# EAGLE design Pi Wedge (EAGLE 6.5.0)
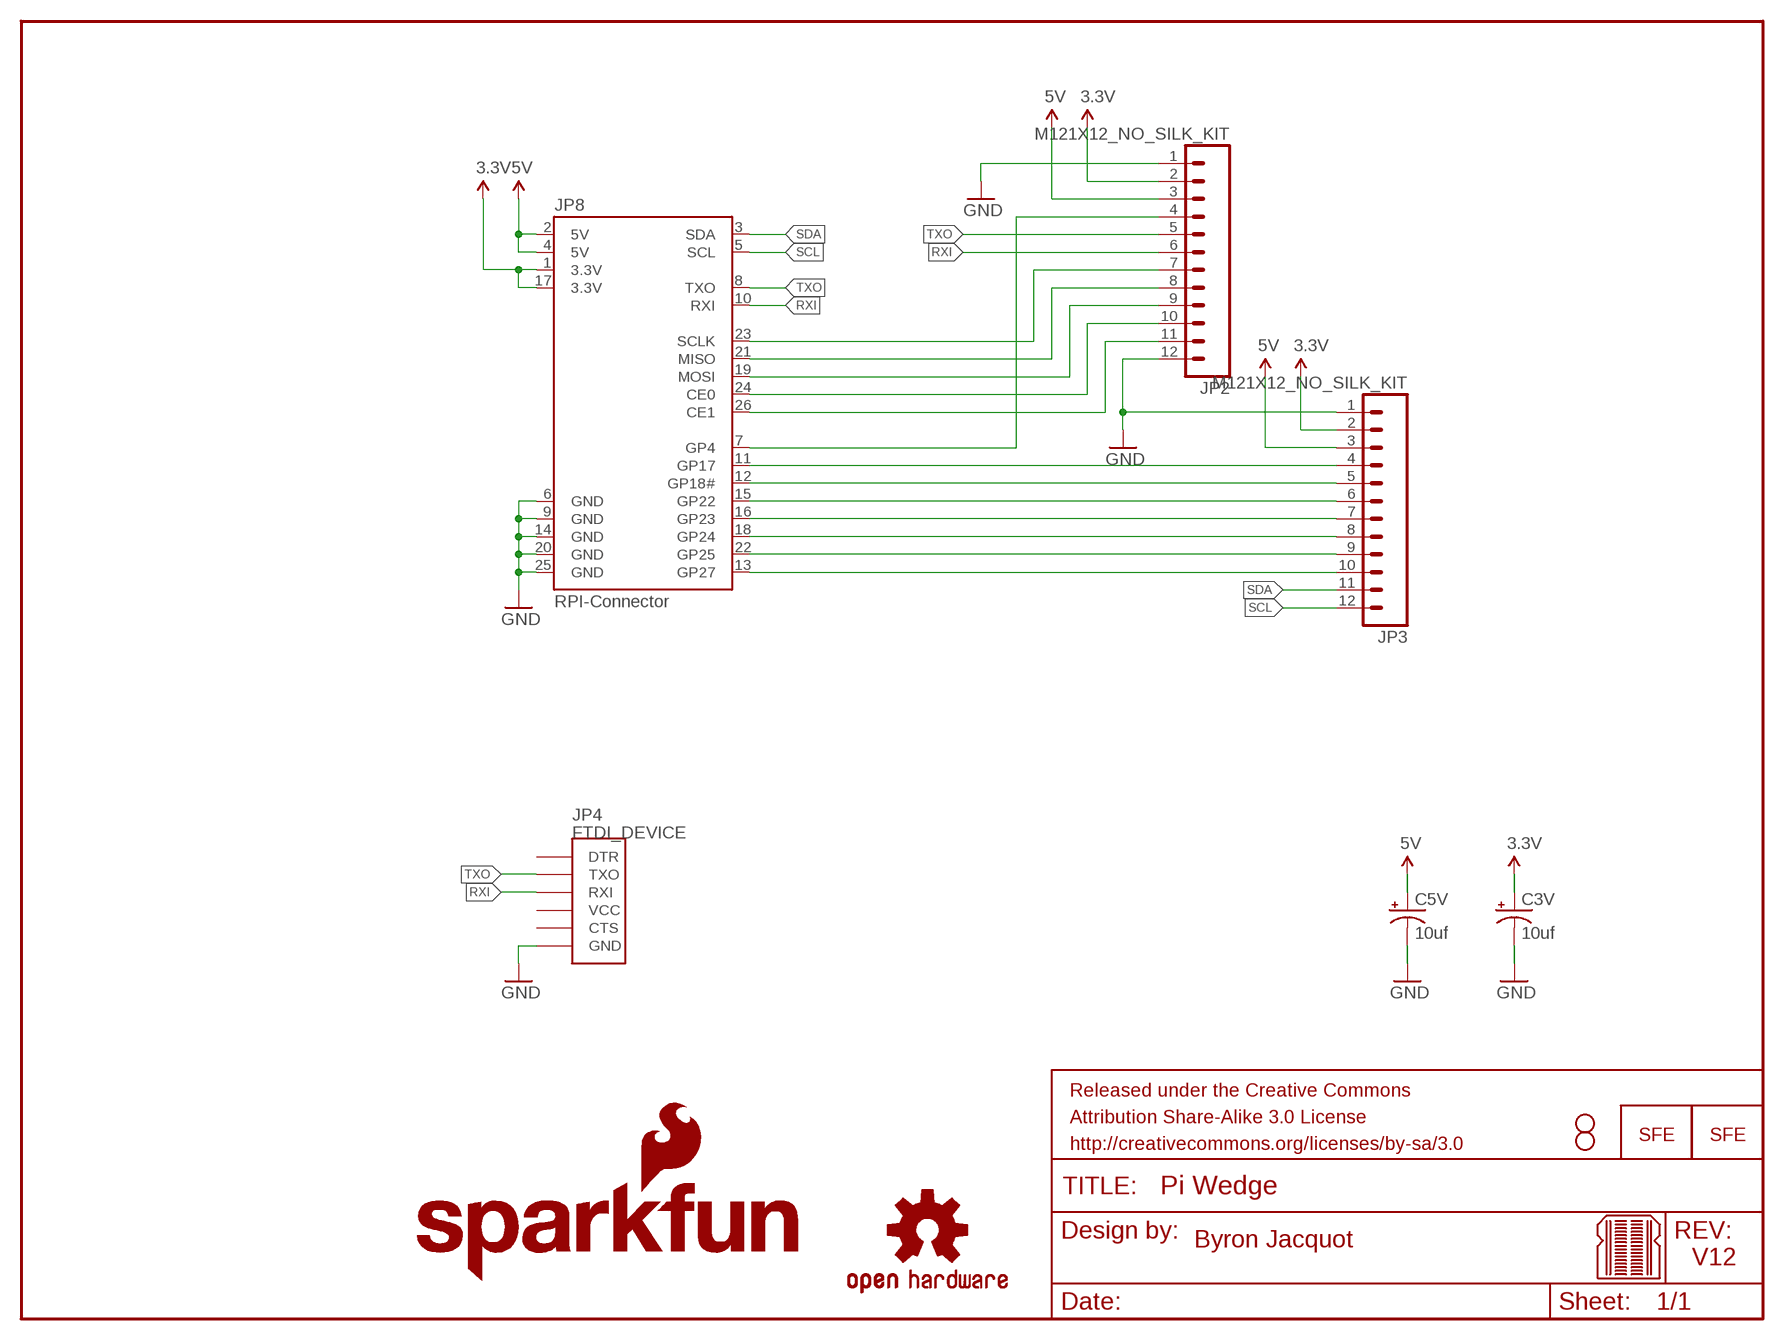
[diagram p0: schematic, sheet 1]

## Parts
C3V  10uf  10UF-25V-20%(PTH)KIT  [CPOL-RADIAL-10UF-25V-KIT]
C5V  10uf  10UF-25V-20%(PTH)KIT  [CPOL-RADIAL-10UF-25V-KIT]
FRAME2  FRAME-LETTER  [CREATIVE_COMMONS]
JP1  LOGO-SFESK  [SFE-LOGO-FLAME]
JP2  M121X12_NO_SILK_KIT  [1X12_NO_SILK_KIT]
JP3  M121X12_NO_SILK_KIT  [1X12_NO_SILK_KIT]
JP4  FTDI_DEVICE  [FTDI_DEVICE_SIDE]
JP5  LOGO-SFESK  [SFE-LOGO-FLAME]
JP8  RPI-Connector  RASPBERRYPI-GPIOPTH  [2X13-SHROUDED]
LOGO1  SFE_LOGO_NAME_FLAME.2_INCH  [SFE_LOGO_NAME_FLAME_.2]
STANDOFF1  STAND-OFF  [STAND-OFF]
STANDOFF2  STAND-OFF  [STAND-OFF]
U$1  OSHW-LOGOS  [OSHW-LOGO-S]
U$2  BREADBOARD_PATTERN  [BREADBOARD_SPACING]

## Nets
3.3V: C3V.1(+) JP2.2 JP3.2 JP8.1(3.3V) JP8.17(3.3V)
5V: C5V.1(+) JP2.3 JP3.3 JP8.2(5V) JP8.4(5V)
CE0: JP2.10 JP8.24(CE0)
CE1: JP2.11 JP8.26(CE1)
GND: C3V.2(-) C5V.2(-) JP2.1 JP2.12 JP3.1 JP4.P$6(GND) JP8.6(GND) JP8.9(GND) JP8.14(GND) JP8.20(GND) JP8.25(GND)
GP4: JP2.4 JP8.7(GP4)
GP17: JP3.4 JP8.11(GP17)
GP18: JP3.5 JP8.12(GP18#)
GP22: JP3.6 JP8.15(GP22)
GP23: JP3.7 JP8.16(GP23)
GP24: JP3.8 JP8.18(GP24)
GP25: JP3.9 JP8.22(GP25)
GP27: JP3.10 JP8.13(GP27)
MISO: JP2.8 JP8.21(MISO)
MOSI: JP2.9 JP8.19(MOSI)
RXI: JP2.6 JP4.P$3(RXI) JP8.10(RXI)
SCL: JP3.12 JP8.5(SCL)
SCLK: JP2.7 JP8.23(SCLK)
SDA: JP3.11 JP8.3(SDA)
TXO: JP2.5 JP4.P$2(TXO) JP8.8(TXO)
Unconnected: JP4.P$1(DTR) JP4.P$4(VCC) JP4.P$5(CTS)

## Notes on the sheet
- Byron Jacquot
- V12

## Library data of the parts
C3V C5V = SparkFun-Capacitors:10UF-25V-20%(PTH): CAP-08440; PROD_ID: CAP-08440
FRAME2 = SparkFun-Aesthetics:FRAME-LETTER: Schematic Frame Standard 8.5x11 US Letter frame
JP1 JP5 = SparkFun:LOGO-SFE: Spark Fun Electronics PCB Logo This is the standard Spark Fun Electronics PCB logo.
JP2 JP3 = SparkFun-Connectors:M12: Header 12 Standard 12-pin 0.1" header. Use with straight break away headers (SKU : PRT-00116), right angle break away headers (PRT-00553), swiss pins (PRT-00743), machine pins (PRT-00117), and female headers (PRT-00115).
JP4 = SparkFun-Connectors:FTDI_DEVICE: Connector which mates to FTDI basic or FTDI cable.
JP8 = SparkFun-Boards:RASPBERRYPI-GPIO: RASPBERRY PI I/O HEADER As defined for the Revistion 2 Pi.; DIST: sparkfun; DIST_ID: PRT-11490
LOGO1 = SparkFun-Aesthetics:SFE_LOGO_NAME_FLAME: SFE Logo, name and flame This is the SparkFun full logo. The logo on the schematic will always be the same size; the package variant is the height of the flame part of the logo. Default layer for the logo on the board is tSilk.
STANDOFF1 STANDOFF2 = SparkFun-Electromechanical:STAND-OFF: #4 Stand Off This is the mechanical footprint for a #4 phillips button head screw. Use the keepout ring to avoid running the screw head into surrounding components. SKU : PRT-00447
U$1 = SparkFun:OSHW-LOGO: Open Source Hardware Logo This logo indicates the piece of hardware it is found on incorporates a OSHW license and/or adheres to the definition of open source hardware found here: http://freedomdefined.org/OSHW
U$2 = SparkFun-Aesthetics:BREADBOARD_PATTERN: Reference markings that correspond to solderless breadboard row spacing.

## Board
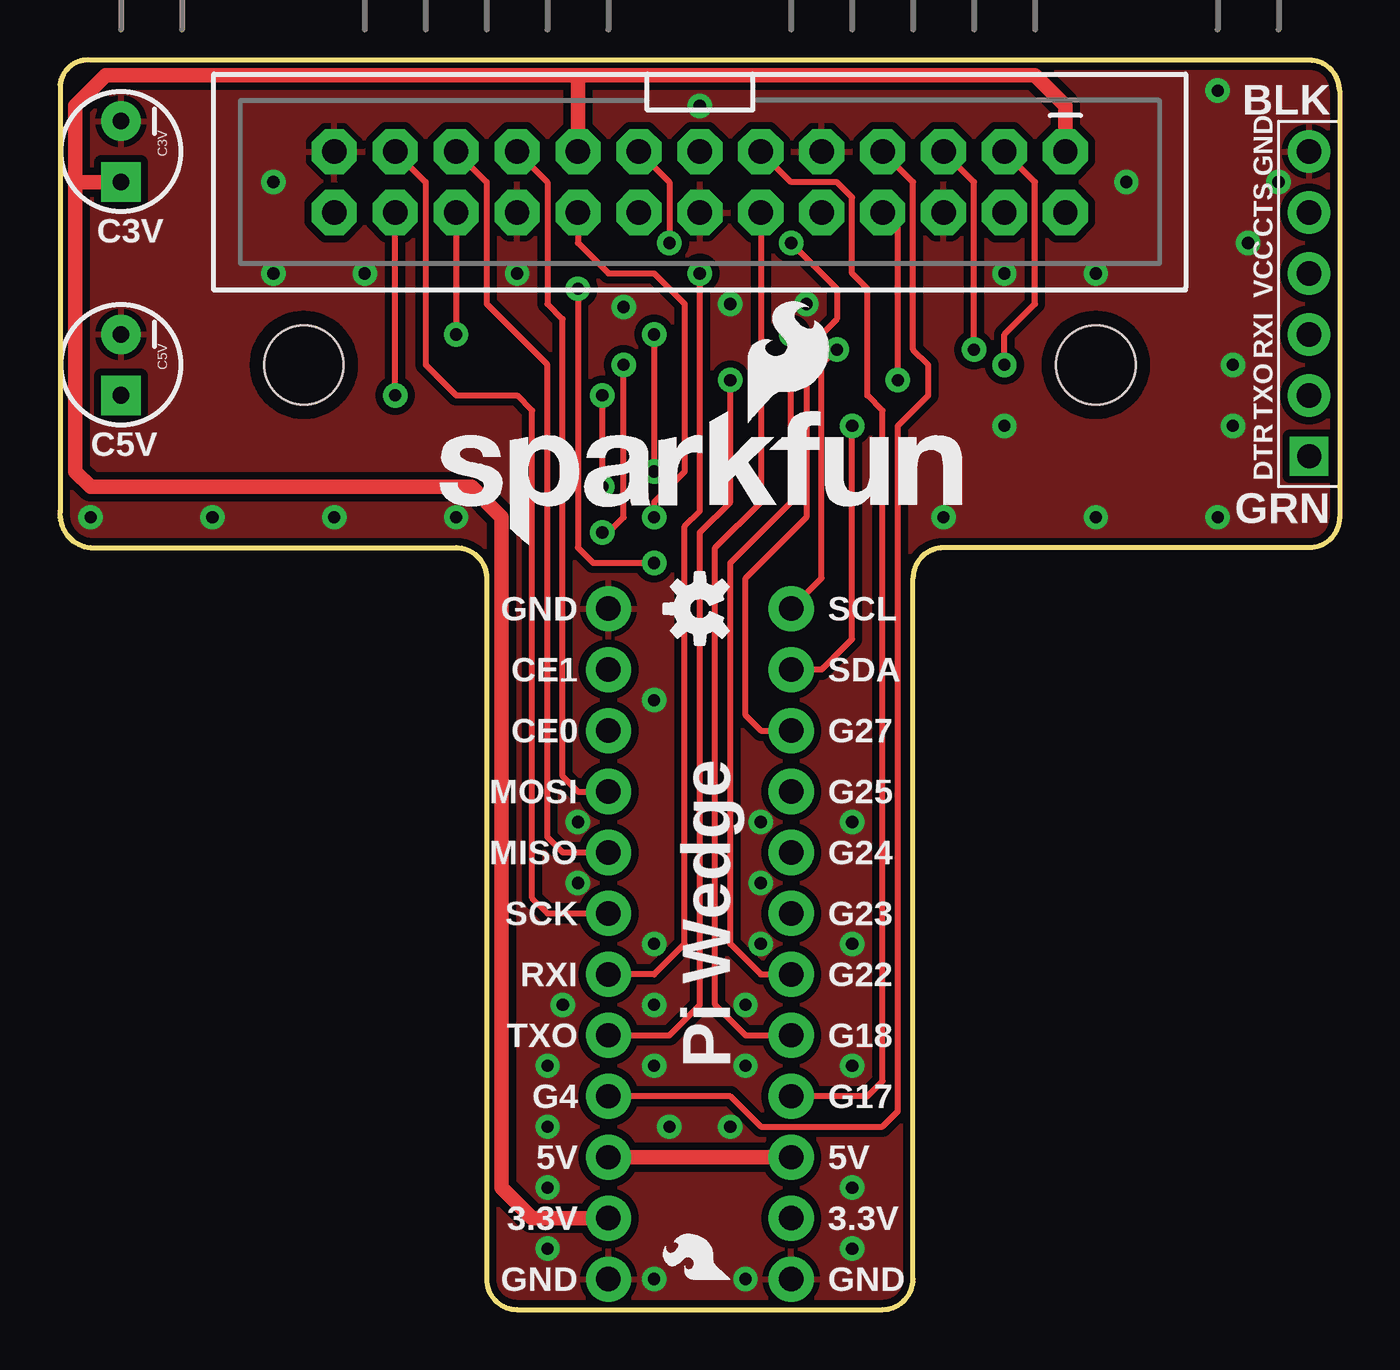
[diagram p1: board, top side]
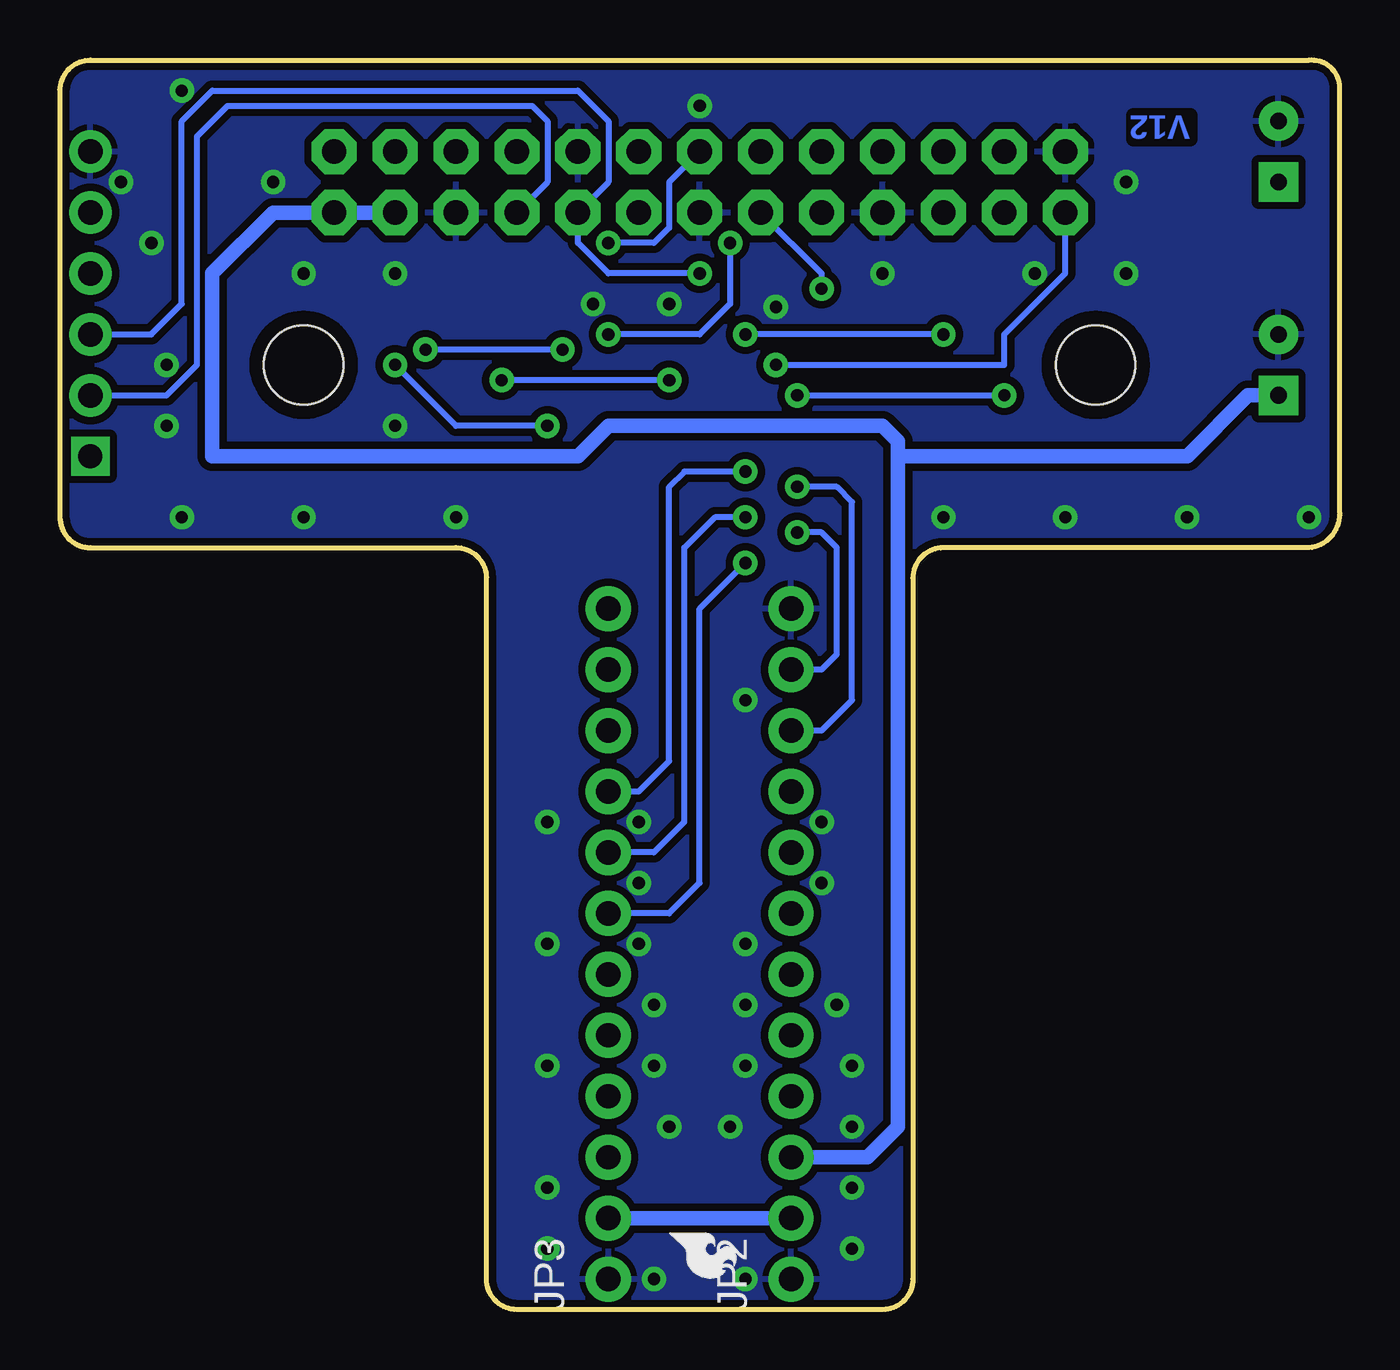
[diagram p2: board, bottom side, seen from below]

Size 53.35 x 52.08 mm. Coordinates in mm from the lower left corner, seen from the top.
Outline: 53.35,50.8 53.35,33.02 arc-90 52.08,31.75 36.84,31.75 arc90 35.57,30.48 35.57,1.27 arc-90 34.3,0 19.06,0 arc-90 17.79,1.27 17.79,30.48 arc90 16.52,31.75 1.28,31.75 arc-90 0.01,33.27 0.01,51.05 arc-90 1.28,52.07 52.08,52.07 arc-90 53.35,50.8
Copper layers (1*16): Top 0.035mm / dielectric 1.5mm / Bottom 0.035mm
Design rules "SparkFun-2-layer *": minimum track width 7mil, minimum drill 15mil, track to track 8mil, track to pad 8mil, pad to pad 8mil, via to via 8mil, smd to smd 8mil, copper to edge 8mil, drill to drill 8mil, minimum pad ring 12mil, minimum via ring 10mil, stop-mask expansion 4mil, vias tented up to drill 20mil, thermal gap 10mil

### Footprints (pad centres in the part's own frame; a part is rotated, then mirrored left to right if it is on the bottom)
CPOL-RADIAL-10UF-25V-KIT = drill 0.7 pad 1.651 square: 1 1.27,0 | drill 0.7 pad 1.651: 2 -1.27,0
1X12_NO_SILK_KIT = drill 1.016 pad 1.88: 1 0,0; 2 2.54,0; 3 5.08,0; 4 7.62,0; 5 10.16,0; 6 12.7,0; 7 15.24,0; 8 17.78,0; 9 20.32,0; 10 22.86,0; 11 25.4,0; 12 27.94,0
FTDI_DEVICE_SIDE = drill 1 square: P$1 -6.35,0 | drill 1.016 pad 1.778: P$2 -3.81,0; P$3 -1.27,0; P$4 1.27,0; P$5 3.81,0; P$6 6.35,0
2X13-SHROUDED = drill 1.016 pad 1.88 octagon: 1 -1.27,15.24; 2 1.27,15.24; 3 -1.27,12.7; 4 1.27,12.7; 5 -1.27,10.16; 6 1.27,10.16; 7 -1.27,7.62; 8 1.27,7.62; 9 -1.27,5.08; 10 1.27,5.08; 11 -1.27,2.54; 12 1.27,2.54; 13 -1.27,0; 14 1.27,0; 15 -1.27,-2.54; 16 1.27,-2.54; 17 -1.27,-5.08; 18 1.27,-5.08; 19 -1.27,-7.62; 20 1.27,-7.62; 21 -1.27,-10.16; 22 1.27,-10.16; 23 -1.27,-12.7; 24 1.27,-12.7; 25 -1.27,-15.24; 26 1.27,-15.24
STAND-OFF = hole 3.302: 0,0

### Placement (x,y rotation side)
C3V  2.55,48.26 270 top
C5V  2.55,39.37 270 top
FRAME2  8.9,-10.16 0 top  (outside the outline)
JP1  27.95,1.27 90 top
JP2  22.87,1.27 90 bottom
JP3  30.49,1.27 90 bottom
JP4  52.08,41.91 90 top
JP5  27.95,3.17 270 bottom
JP8  26.68,46.99 270 top
LOGO1  15.12,31.75 0 top
STANDOFF1  10.17,39.37 0 top
STANDOFF2  43.19,39.37 0 top
U$1  26.68,29.21 90 top
U$2  26.68,54.61 0 top

### Tracks (layer width: path | path; a pad name or v marks a point on that pad's centre or on a via)
3.3V
  Top 0.61: 21.6,51.44 40.65,51.44 41.92,50.16 JP8.1 | 21.6,51.44 JP8.17 | 0.64,46.99 0.64,34.92 1.28,34.29 17.15,34.29 18.42,33.02 18.42,5.08 19.69,3.81 JP2.2 | 0.64,46.99 0.64,50.16 1.91,51.44 21.6,51.44 | C3V.1 0.64,46.99
  Bottom 0.61: JP2.2 JP3.2
5V
  Top 0.61: JP2.3 JP3.3
  Bottom 0.61: JP8.4 JP8.2 44.46,45.72 47,43.18 47,35.56 31.76,35.56 30.49,36.83 19.06,36.83 18.42,36.2 18.42,35.56 | 18.42,35.56 6.36,35.56 3.82,38.1 C5V.1 | 18.42,35.56 18.42,7.62 19.69,6.35 JP2.3
CE0  (via drill 0.51)
  Top 0.254: v22.61,34.29 v22.61,38.1 | v13.98,38.1 JP8.24
  Bottom 0.254: v22.61,34.29 20.96,34.29 20.33,33.66 20.33,25.4 21.6,24.13 JP2.10 | v22.61,38.1 v13.98,38.1
CE1  (via drill 0.51)
  Top 0.254: v22.61,32.38 22.87,32.38 23.5,33.02 v23.5,39.37
  Bottom 0.254: v22.61,32.38 21.6,32.38 20.96,31.75 20.96,27.3 21.6,26.67 JP2.11 | v23.5,39.37 13.98,39.37 13.98,40.64 11.44,43.18 JP8.26
GND  (via drill 0.51)
  other vias: 48.9,36.83 44.46,46.99 16.52,33.02 26.68,50.16 20.33,10.16 20.33,7.62 25.41,7.62 27.95,7.62 24.77,10.16 28.58,10.16 20.96,12.7 33.03,5.08 27.95,41.91 19.06,43.18 23.5,41.78 33.03,10.16 33.03,15.24 33.03,20.32 12.71,43.18 29.22,20.32 29.22,17.78 29.22,15.24 21.6,17.78 43.19,43.18 8.9,46.99 36.84,33.02 24.77,15.24 24.77,25.4 39.38,36.83 43.19,33.02 8.9,43.18 50.81,46.99 11.44,33.02 20.33,5.08 48.27,50.8 48.9,39.37 6.36,33.02 1.28,33.02 48.27,33.02 49.54,44.45 20.33,2.54 28.58,1.27 33.03,2.54 24.77,12.7 28.58,12.7 31.12,41.91 39.38,43.18 21.6,20.32 24.77,1.27
  pour Bottom (isolate 0.305): 1.28,31.75 16.52,31.75 arc-90 17.79,30.48 17.79,1.27 arc90 19.06,0 34.3,0 arc90 35.57,1.27 35.57,30.48 arc-90 36.84,31.75 52.08,31.75 arc90 53.35,33.02 53.35,50.8 arc90 52.08,52.07 1.28,52.07 arc90 0.01,50.93 0.01,33.15 arc90
  pour Top (isolate 0.305): 35.57,30.48 35.57,1.27 arc-90 34.3,0 19.06,0 arc-90 17.79,1.27 17.79,30.48 arc90 16.52,31.75 1.28,31.75 arc-90 0.01,33.15 0.01,50.93 arc-90 1.28,52.07 52.08,52.07 arc-90 53.35,50.8 53.35,33.02 arc-90 52.08,31.75 36.84,31.75 arc90
GP4
  Top 0.254: JP8.7 35.57,46.99 35.57,40.01 36.2,39.37 36.2,38.1 34.93,36.83 34.93,8.26 34.3,7.62 29.22,7.62 27.95,8.89 JP2.4
GP17
  Top 0.254: JP8.11 30.49,46.99 32.39,46.99 33.03,46.35 33.03,43.18 33.66,42.55 33.66,38.1 34.3,37.47 34.3,9.53 33.66,8.89 JP3.4
GP18
  Top 0.254: JP8.12 29.22,33.66 27.31,31.75 27.31,12.7 28.58,11.43 JP3.5
GP22  (via drill 0.51)
  Top 0.254: JP8.15 25.41,46.99 v25.41,44.45 | v30.49,40.64 30.49,33.66 27.95,31.11 27.95,15.24 29.22,13.97 JP3.6
  Bottom 0.254: v25.41,44.45 25.41,41.91 26.68,40.64 v30.49,40.64
GP23  (via drill 0.51)
  Top 0.254: v21.6,42.55 21.6,31.75 22.23,31.11 v24.77,31.11
  Bottom 0.254: JP8.16 21.6,43.18 v21.6,42.55 | v24.77,31.11 26.68,29.21 26.68,17.78 27.95,16.51 JP3.7
GP24  (via drill 0.51)
  Top 0.254: JP8.18 21.6,44.45 22.87,43.18 24.77,43.18 26.04,41.91 26.04,34.92 24.77,33.66 v24.77,33.02
  Bottom 0.254: v24.77,33.02 26.04,33.02 27.31,31.75 27.31,20.32 28.58,19.05 JP3.8
GP25  (via drill 0.51)
  Top 0.254: JP8.22 v16.52,40.64 | v24.77,40.64 v24.77,34.92
  Bottom 0.254: v16.52,40.64 v24.77,40.64 | v24.77,34.92 27.31,34.92 27.95,34.29 27.95,22.86 29.22,21.59 JP3.9
GP27  (via drill 0.51)
  Top 0.254: v30.49,44.45 32.39,42.55 32.39,41.27 31.12,40.01 31.12,33.02 28.58,30.48 28.58,24.77 29.22,24.13 JP3.10
  Bottom 0.254: JP8.13 27.95,46.99 27.95,45.09 28.58,44.45 v30.49,44.45
MISO
  Top 0.254: JP8.21 17.79,46.99 17.79,41.91 20.33,39.37 20.33,19.68 20.96,19.05 JP2.8
MOSI
  Top 0.254: JP8.19 20.33,46.99 20.33,41.91 20.96,41.27 20.96,22.23 21.6,21.59 JP2.9
RXI  (via drill 0.51)
  Top 0.254: v26.68,43.18 26.68,33.27 26.04,32.64 26.04,15.24 24.77,13.97 JP2.6
  Bottom 0.254: v26.68,43.18 30.49,43.18 31.76,44.45 JP8.10 30.49,46.99 30.49,49.53 31.76,50.8 47,50.8 48.27,49.53 48.27,41.91 49.54,40.64 JP4.P$3
SCL  (via drill 0.51)
  Top 0.254: v32.39,40.01 31.76,39.37 31.76,30.48 JP3.12 | v38.11,40.01 38.11,46.99 JP8.5
  Bottom 0.254: v32.39,40.01 v38.11,40.01
SCLK
  Top 0.254: JP8.23 15.25,46.99 15.25,39.37 16.52,38.1 19.06,38.1 19.69,37.47 19.69,17.14 20.33,16.51 JP2.7
SDA  (via drill 0.51)
  Top 0.254: v33.03,36.83 33.03,27.94 31.76,26.67 JP3.11 | v39.38,39.37 39.38,40.64 40.65,41.91 40.65,46.99 JP8.3
  Bottom 0.254: v33.03,36.83 36.84,36.83 v39.38,39.37
TXO  (via drill 0.51)
  Top 0.254: v27.95,38.73 27.95,33.66 26.68,32.38 26.68,12.7 25.41,11.43 JP2.5 | v34.93,38.73 34.93,45.09 JP8.8
  Bottom 0.254: JP8.8 33.03,46.99 33.03,49.53 33.66,50.16 46.36,50.16 47.63,48.9 47.63,39.37 48.9,38.1 JP4.P$2 | v27.95,38.73 v34.93,38.73

### Text on the board
Bottom: V12
tPlace: C3V | C5V | GND | SCL | CE1 | SDA | CE0 | G27 | MOSI | G25 | MISO | G24 | SCK | Pi Wedge | G23 | RXI | G22 | TXO | G18 | G4 | G17 | 5V | 5V | 3.3V | 3.3V | GND | GND
tDocu: Byron Jacquot